# Altium schematic sheet PROB_S7CAS_ADC.SchDoc
size Tabloid; SheetNumber: 13; SheetTotal: 15; Sheet_Name: Convertisseur Analogique à Numérique; Size: 11x17
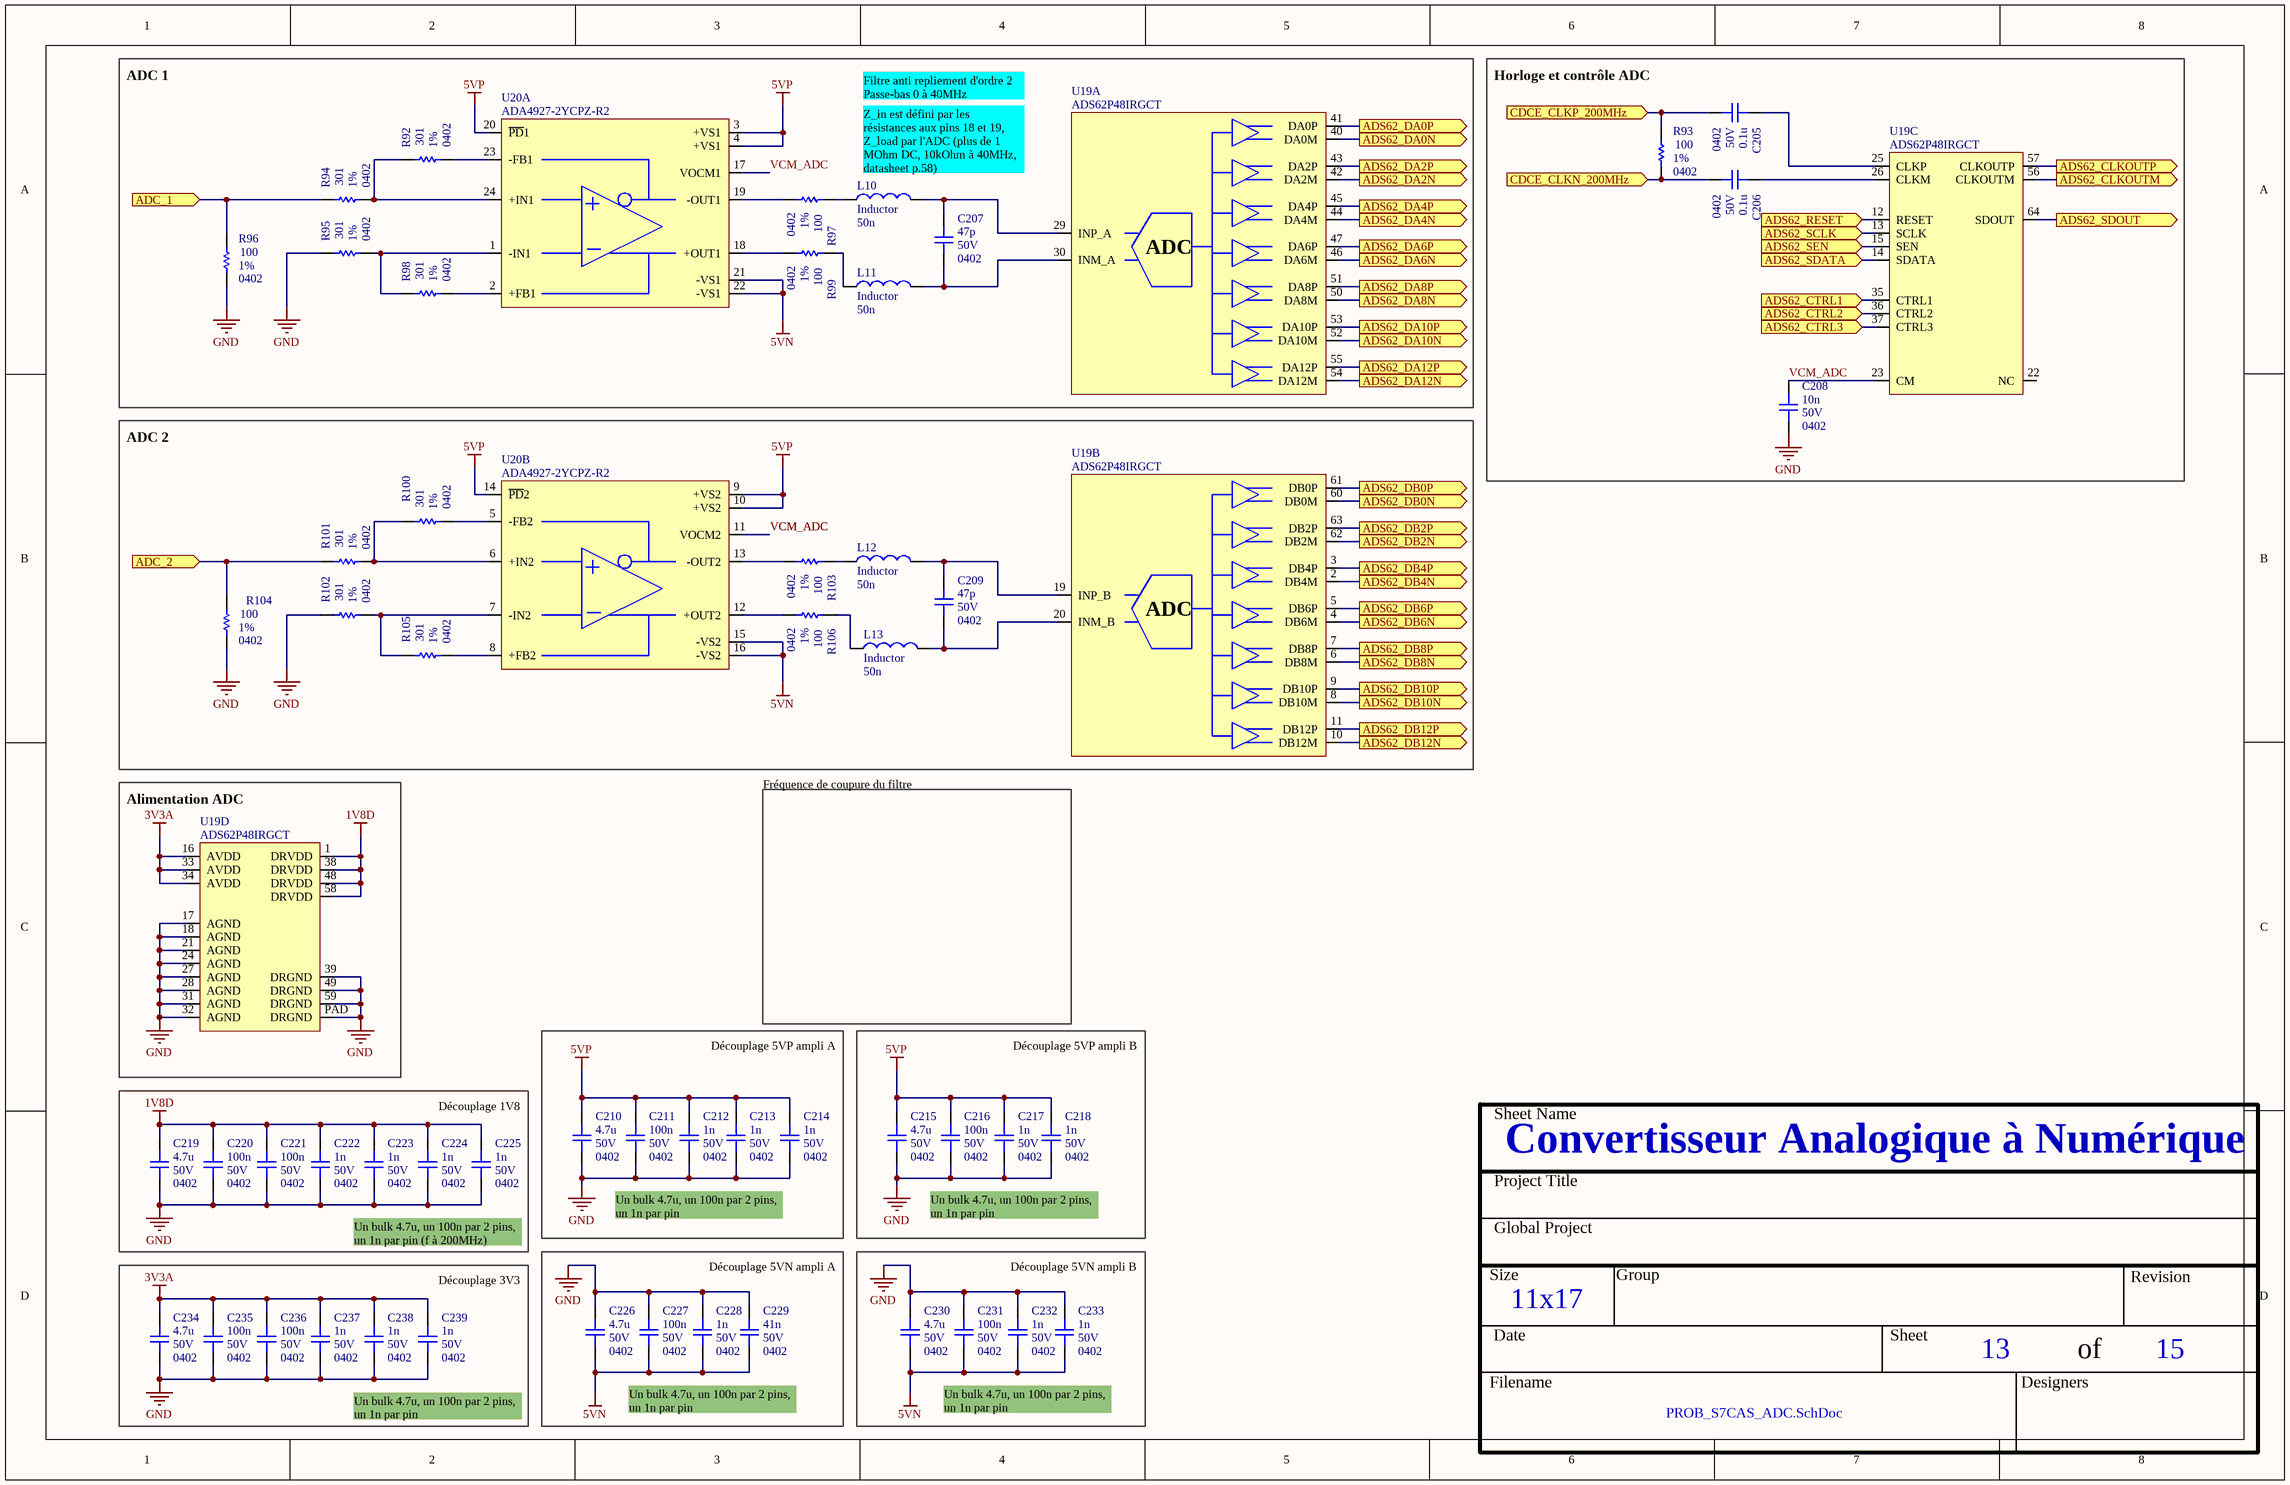
[diagram p0: PROB_S7CAS_ADC.SchDoc]

## Parts
C205  value 0.1u  Voltage: 50V  Package: 0402  [CAP_0402]  (hidden comment: CAP - 0402)
C206  value 0.1u  Voltage: 50V  Package: 0402  [CAP_0402]  (hidden comment: CAP - 0402)
C207  value 47p  Voltage: 50V  Package: 0402  [CAP_0402]  (hidden comment: CAP - 0402)
C208  value 10n  Voltage: 50V  Package: 0402  [CAP_0402]  (hidden comment: CAP - 0402)
C209  value 47p  Voltage: 50V  Package: 0402  [CAP_0402]  (hidden comment: CAP - 0402)
C210  value 4.7u  Voltage: 50V  Package: 0402  [CAP_0402]  (hidden comment: CAP - 0402)
C211  value 100n  Voltage: 50V  Package: 0402  [CAP_0402]  (hidden comment: CAP - 0402)
C212  value 1n  Voltage: 50V  Package: 0402  [CAP_0402]  (hidden comment: CAP - 0402)
C213  value 1n  Voltage: 50V  Package: 0402  [CAP_0402]  (hidden comment: CAP - 0402)
C214  value 1n  Voltage: 50V  Package: 0402  [CAP_0402]  (hidden comment: CAP - 0402)
C215  value 4.7u  Voltage: 50V  Package: 0402  [CAP_0402]  (hidden comment: CAP - 0402)
C216  value 100n  Voltage: 50V  Package: 0402  [CAP_0402]  (hidden comment: CAP - 0402)
C217  value 1n  Voltage: 50V  Package: 0402  [CAP_0402]  (hidden comment: CAP - 0402)
C218  value 1n  Voltage: 50V  Package: 0402  [CAP_0402]  (hidden comment: CAP - 0402)
C219  value 4.7u  Voltage: 50V  Package: 0402  [CAP_0402]  (hidden comment: CAP - 0402)
C220  value 100n  Voltage: 50V  Package: 0402  [CAP_0402]  (hidden comment: CAP - 0402)
C221  value 100n  Voltage: 50V  Package: 0402  [CAP_0402]  (hidden comment: CAP - 0402)
C222  value 1n  Voltage: 50V  Package: 0402  [CAP_0402]  (hidden comment: CAP - 0402)
C223  value 1n  Voltage: 50V  Package: 0402  [CAP_0402]  (hidden comment: CAP - 0402)
C224  value 1n  Voltage: 50V  Package: 0402  [CAP_0402]  (hidden comment: CAP - 0402)
C225  value 1n  Voltage: 50V  Package: 0402  [CAP_0402]  (hidden comment: CAP - 0402)
C226  value 4.7u  Voltage: 50V  Package: 0402  [CAP_0402]  (hidden comment: CAP - 0402)
C227  value 100n  Voltage: 50V  Package: 0402  [CAP_0402]  (hidden comment: CAP - 0402)
C228  value 1n  Voltage: 50V  Package: 0402  [CAP_0402]  (hidden comment: CAP - 0402)
C229  value 41n  Voltage: 50V  Package: 0402  [CAP_0402]  (hidden comment: CAP - 0402)
C230  value 4.7u  Voltage: 50V  Package: 0402  [CAP_0402]  (hidden comment: CAP - 0402)
C231  value 100n  Voltage: 50V  Package: 0402  [CAP_0402]  (hidden comment: CAP - 0402)
C232  value 1n  Voltage: 50V  Package: 0402  [CAP_0402]  (hidden comment: CAP - 0402)
C233  value 1n  Voltage: 50V  Package: 0402  [CAP_0402]  (hidden comment: CAP - 0402)
C234  value 4.7u  Voltage: 50V  Package: 0402  [CAP_0402]  (hidden comment: CAP - 0402)
C235  value 100n  Voltage: 50V  Package: 0402  [CAP_0402]  (hidden comment: CAP - 0402)
C236  value 100n  Voltage: 50V  Package: 0402  [CAP_0402]  (hidden comment: CAP - 0402)
C237  value 1n  Voltage: 50V  Package: 0402  [CAP_0402]  (hidden comment: CAP - 0402)
C238  value 1n  Voltage: 50V  Package: 0402  [CAP_0402]  (hidden comment: CAP - 0402)
C239  value 1n  Voltage: 50V  Package: 0402  [CAP_0402]  (hidden comment: CAP - 0402)
L10  Inductor  value 50n  [INDM5250X66N]
L11  Inductor  value 50n  [INDM5250X66N]
L12  Inductor  value 50n  [INDM5250X66N]
L13  Inductor  value 50n  [INDM5250X66N]
R92  value 301  Package: 0402  Precision: 1%  [RES_0402]  (hidden comment: RES - 0402)
R93  value 100  Package: 0402  Precision: 1%  [RES_0402]  (hidden comment: RES - 0402)
R94  value 301  Package: 0402  Precision: 1%  [RES_0402]  (hidden comment: RES - 0402)
R95  value 301  Package: 0402  Precision: 1%  [RES_0402]  (hidden comment: RES - 0402)
R96  value 100  Package: 0402  Precision: 1%  [RES_0402]  (hidden comment: RES - 0402)
R97  value 100  Package: 0402  Precision: 1%  [RES_0402]  (hidden comment: RES - 0402)
R98  value 301  Package: 0402  Precision: 1%  [RES_0402]  (hidden comment: RES - 0402)
R99  value 100  Package: 0402  Precision: 1%  [RES_0402]  (hidden comment: RES - 0402)
R100  value 301  Package: 0402  Precision: 1%  [RES_0402]  (hidden comment: RES - 0402)
R101  value 301  Package: 0402  Precision: 1%  [RES_0402]  (hidden comment: RES - 0402)
R102  value 301  Package: 0402  Precision: 1%  [RES_0402]  (hidden comment: RES - 0402)
R103  value 100  Package: 0402  Precision: 1%  [RES_0402]  (hidden comment: RES - 0402)
R104  value 100  Package: 0402  Precision: 1%  [RES_0402]  (hidden comment: RES - 0402)
R105  value 301  Package: 0402  Precision: 1%  [RES_0402]  (hidden comment: RES - 0402)
R106  value 100  Package: 0402  Precision: 1%  [RES_0402]  (hidden comment: RES - 0402)
U19  ADS62P48IRGCT  [ADC_ADS62P48IRGCT]  (parts A,B,C,D of 4)
U20  ADA4927-2YCPZ-R2  [OPAMP_ADA4927-2YCPZ-R2]  (parts A,B of 2)

## Ports
ADC_1 (in), ADC_2 (in), ADS62_CLKOUTM (out), ADS62_CLKOUTP (out), ADS62_CTRL1 (in), ADS62_CTRL2 (in), ADS62_CTRL3 (in), ADS62_DA0N (out), ADS62_DA0P (out), ADS62_DA2N (out), ADS62_DA2P (out), ADS62_DA4N (out), ADS62_DA4P (out), ADS62_DA6N (out), ADS62_DA6P (out), ADS62_DA8N (out), ADS62_DA8P (out), ADS62_DA10N (out), ADS62_DA10P (out), ADS62_DA12N (out), ADS62_DA12P (out), ADS62_DB0N (out), ADS62_DB0P (out), ADS62_DB2N (out), ADS62_DB2P (out), ADS62_DB4N (out), ADS62_DB4P (out), ADS62_DB6N (out), ADS62_DB6P (out), ADS62_DB8N (out), ADS62_DB8P (out), ADS62_DB10N (out), ADS62_DB10P (out), ADS62_DB12N (out), ADS62_DB12P (out), ADS62_RESET (in), ADS62_SCLK (in), ADS62_SDATA (in), ADS62_SDOUT (out), ADS62_SEN (in), CDCE_CLKN_200MHz (in), CDCE_CLKP_200MHz (in)

## Nets
1V8D: C219.2 C220.2 C221.2 C222.2 C223.2 C224.2 C225.2 U19.1(DRVDD) U19.38(DRVDD) U19.48(DRVDD) U19.58(DRVDD)
3V3A: C234.2 C235.2 C236.2 C237.2 C238.2 C239.2 U19.16(AVDD) U19.33(AVDD) U19.34(AVDD)
5VN: C226.1 C227.1 C228.1 C229.1 C230.1 C231.1 C232.1 C233.1 U20.15(-VS2) U20.16(-VS2) U20.21(-VS1) U20.22(-VS1)
5VP: C210.2 C211.2 C212.2 C213.2 C214.2 C215.2 C216.2 C217.2 C218.2 U20.3(+VS1) U20.4(+VS1) U20.9(+VS2) U20.10(+VS2) U20.14(~{PD}2) U20.20(~{PD}1)
GND: C208.1 C210.1 C211.1 C212.1 C213.1 C214.1 C215.1 C216.1 C217.1 C218.1 C219.1 C220.1 C221.1 C222.1 C223.1 C224.1 C225.1 C226.2 C227.2 C228.2 C229.2 C230.2 C231.2 C232.2 C233.2 C234.1 C235.1 C236.1 C237.1 C238.1 C239.1 R95.2 R96.1 R102.2 R104.1 U19.17(AGND) U19.18(AGND) U19.21(AGND) U19.24(AGND) U19.27(AGND) U19.28(AGND) U19.31(AGND) U19.32(AGND) U19.39(DRGND) U19.49(DRGND) U19.59(DRGND) U19.PAD(DRGND)
ADC_1: R94.2 R96.2 ; port ADC_1
ADC_2: R101.2 R104.2 ; port ADC_2
ADS62_CLKOUTM: U19.56(CLKOUTM) ; port ADS62_CLKOUTM
ADS62_CLKOUTP: U19.57(CLKOUTP) ; port ADS62_CLKOUTP
ADS62_CTRL1: U19.35(CTRL1) ; port ADS62_CTRL1
ADS62_CTRL2: U19.36(CTRL2) ; port ADS62_CTRL2
ADS62_CTRL3: U19.37(CTRL3) ; port ADS62_CTRL3
ADS62_DA0N: U19.40(DA0M) ; port ADS62_DA0N
ADS62_DA0P: U19.41(DA0P) ; port ADS62_DA0P
ADS62_DA2N: U19.42(DA2M) ; port ADS62_DA2N
ADS62_DA2P: U19.43(DA2P) ; port ADS62_DA2P
ADS62_DA4N: U19.44(DA4M) ; port ADS62_DA4N
ADS62_DA4P: U19.45(DA4P) ; port ADS62_DA4P
ADS62_DA6N: U19.46(DA6M) ; port ADS62_DA6N
ADS62_DA6P: U19.47(DA6P) ; port ADS62_DA6P
ADS62_DA8N: U19.50(DA8M) ; port ADS62_DA8N
ADS62_DA8P: U19.51(DA8P) ; port ADS62_DA8P
ADS62_DA10N: U19.52(DA10M) ; port ADS62_DA10N
ADS62_DA10P: U19.53(DA10P) ; port ADS62_DA10P
ADS62_DA12N: U19.54(DA12M) ; port ADS62_DA12N
ADS62_DA12P: U19.55(DA12P) ; port ADS62_DA12P
ADS62_DB0N: U19.60(DB0M) ; port ADS62_DB0N
ADS62_DB0P: U19.61(DB0P) ; port ADS62_DB0P
ADS62_DB2N: U19.62(DB2M) ; port ADS62_DB2N
ADS62_DB2P: U19.63(DB2P) ; port ADS62_DB2P
ADS62_DB4N: U19.2(DB4M) ; port ADS62_DB4N
ADS62_DB4P: U19.3(DB4P) ; port ADS62_DB4P
ADS62_DB6N: U19.4(DB6M) ; port ADS62_DB6N
ADS62_DB6P: U19.5(DB6P) ; port ADS62_DB6P
ADS62_DB8N: U19.6(DB8M) ; port ADS62_DB8N
ADS62_DB8P: U19.7(DB8P) ; port ADS62_DB8P
ADS62_DB10N: U19.8(DB10M) ; port ADS62_DB10N
ADS62_DB10P: U19.9(DB10P) ; port ADS62_DB10P
ADS62_DB12N: U19.10(DB12M) ; port ADS62_DB12N
ADS62_DB12P: U19.11(DB12P) ; port ADS62_DB12P
ADS62_RESET: U19.12(RESET) ; port ADS62_RESET
ADS62_SCLK: U19.13(SCLK) ; port ADS62_SCLK
ADS62_SDATA: U19.14(SDATA) ; port ADS62_SDATA
ADS62_SDOUT: U19.64(SDOUT) ; port ADS62_SDOUT
ADS62_SEN: U19.15(SEN) ; port ADS62_SEN
CDCE_CLKN_200MHz: C206.1 R93.1 ; port CDCE_CLKN_200MHz
CDCE_CLKP_200MHz: C205.1 R93.2 ; port CDCE_CLKP_200MHz
VCM_ADC: C208.2 U19.23(CM) U20.11(VOCM2) U20.17(VOCM1)
NetC205_2: C205.2 U19.25(CLKP)
NetC206_2: C206.2 U19.26(CLKM)
NetC207_1: C207.1 L11.2 U19.30(INM_A)
NetC207_2: C207.2 L10.2 U19.29(INP_A)
NetC209_1: C209.1 L13.2 U19.20(INM_B)
NetC209_2: C209.2 L12.2 U19.19(INP_B)
NetL10_1: L10.1 R97.2
NetL11_1: L11.1 R99.2
NetL12_1: L12.1 R103.2
NetL13_1: L13.1 R106.2
NetR92_1: R92.1 U20.23(-FB1)
NetR92_2: R92.2 R94.1 U20.24(+IN1)
NetR95_1: R95.1 R98.2 U20.1(-IN1)
NetR97_1: R97.1 U20.19(-OUT1)
NetR98_1: R98.1 U20.2(+FB1)
NetR99_1: R99.1 U20.18(+OUT1)
NetR100_1: R100.1 U20.5(-FB2)
NetR100_2: R100.2 R101.1 U20.6(+IN2)
NetR102_1: R102.1 R105.2 U20.7(-IN2)
NetR103_1: R103.1 U20.13(-OUT2)
NetR105_1: R105.1 U20.8(+FB2)
NetR106_1: R106.1 U20.12(+OUT2)

Not connected (* = marked no-connect by the designer): U19 22(NC)

## Notes on the sheet
- ADC 1
- Filtre anti repliement d'ordre 2 Passe-bas 0 à 40MHz
- (near C205) Horloge et contrôle ADC
- (near L10) Z_in est défini par les résistances aux pins 18 et 19, Z_load par l'ADC (plus de 1 MOhm DC, 10kOhm à 40MHz, datasheet p.58)
- ADC 2
- (near U19) Alimentation ADC
- Fréquence de coupure du filtre
- Découplage 5VP ampli A
- Découplage 5VP ampli B
- Découplage 1V8
- Un bulk 4.7u, un 100n par 2 pins, un 1n par pin (f à 200MHz)
- Un bulk 4.7u, un 100n par 2 pins, un 1n par pin
- Découplage 3V3
- Découplage 5VN ampli A
- Découplage 5VN ampli B
- Sheet Name
- Project Title
- Global Project
- Size
- Group
- Revision
- Date
- Sheet
- of
- Filename
- Designers
- (in symbol ADC_ADS62P48IRGCT, part A) ADC
- (in symbol ADC_ADS62P48IRGCT, part B) ADC

## Library data of the parts
C205-C239 = CAP - 0402: Precision: 10%; Current: *; CreatedBy: Jonathan Bouchard; Power: *
L10-L13 = Inductor: IND PWR BEAD 50NH 48A SMD; GRAMS Lib Spec: 2.7; HelpURL: https://productfinder.pulseelectronics.com/api/open/part-attachments/datasheet/pa5190.500hlt
R92-R106 = RES - 0402: Voltage: 50V; Power: 1/16W; Current: *; CreatedBy: Jonathan Bouchard
U19 = ADC_ADS62P48IRGCT: ADC - 14 BIT 210MSPS SUAL - VQFN-64; Voltage: 3.15 V ~ 3.6 V / 1.7 V ~ 1.9 V; Mfg: Texas Instruments; Precision: 14 Bit; Current: *; Power: *; Mfg Part Number: ADS62P48IRGCT; HelpURL: http://www.ti.com/lit/ds/symlink/ads62p48.pdf; CreatedBy: Jonathan Bouchard; Temperature: -40°C ~ 85°C; Value: *; Package: VQFN-64; Supplier 1: Digikey; Supplier Part Number 1: 296-24611-1-ND
U20 = OPAMP_ADA4927-2YCPZ-R2: OPAMP - CFA 2.3GHZ - QFN-24; Voltage: 4.5 V ~ 11 V, ±2.25 V ~ 5.5 V; Current: 65mA; Mfg: Analog Devices; Power: *; Mfg Part Number: ADA4927-2YCPZ-R2; HelpURL: http://www.analog.com/media/en/technical-documentation/data-sheets/ADA4927-1_4927-2.pdf; CreatedBy: Jonathan Bouchard; Temperature: -40°C ~ 105°C; Value: *; Precision: *; Package: QFN-24; Supplier 1: Digikey; Supplier Part Number 1: ADA4927-2YCPZ-R2CT-ND